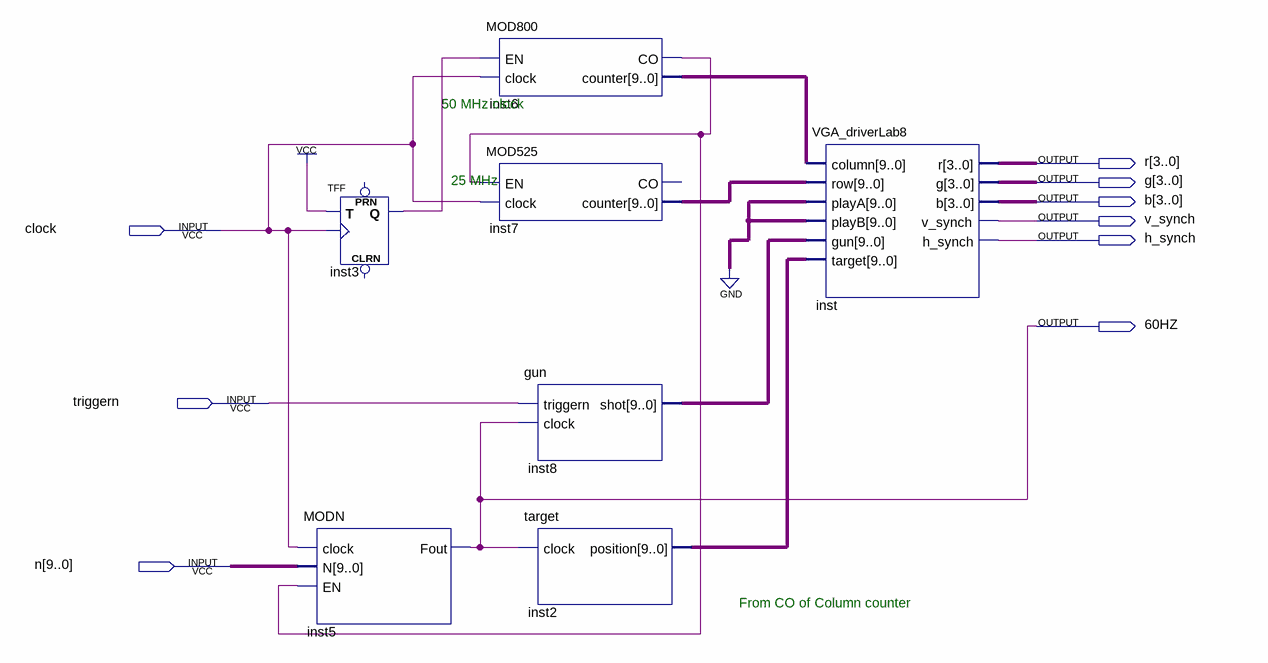
[diagram p0: schematic sheet]
// Quartus schematic system.bdf as structural Verilog: 7 symbols, 9 pins
module system (
  input  clock,
  input  triggern,
  input  [9:0] n,
  output [3:0] r,
  output [3:0] g,
  output [3:0] b,
  output v_synch,
  output h_synch,
  output \60HZ 
);

  wire inst3_q, inst6_co;
  wire [9:0] inst2_position, inst6_counter, inst7_counter, inst8_shot;

  MODN inst5 (.clock(clock), .N(n), .EN(inst6_co), .Fout(\60HZ ));
  TFF inst3 (.T(1'b1), .CLK(clock), .Q(inst3_q));  // open: PRN, CLRN
  MOD800 inst6 (.EN(inst3_q), .clock(clock), .CO(inst6_co), .counter(inst6_counter));
  MOD525 inst7 (.EN(inst6_co), .clock(clock), .counter(inst7_counter));  // open: CO
  gun inst8 (.triggern(triggern), .clock(\60HZ ), .shot(inst8_shot));
  target inst2 (.clock(\60HZ ), .position(inst2_position));
  VGA_driverLab8 inst (
    .column(inst6_counter), .row(inst7_counter), .playA({10{1'b0}}), .playB({10{1'b0}}), .gun(inst8_shot),
    .target(inst2_position), .r(r), .g(g), .b(b), .v_synch(v_synch), .h_synch(h_synch));

  // Notes on the sheet:
  //   50 MHz clock
  //   25 MHz 
  //   From CO of Column counter
endmodule
